# EAGLE design esp32_component (EAGLE 9.5.2)
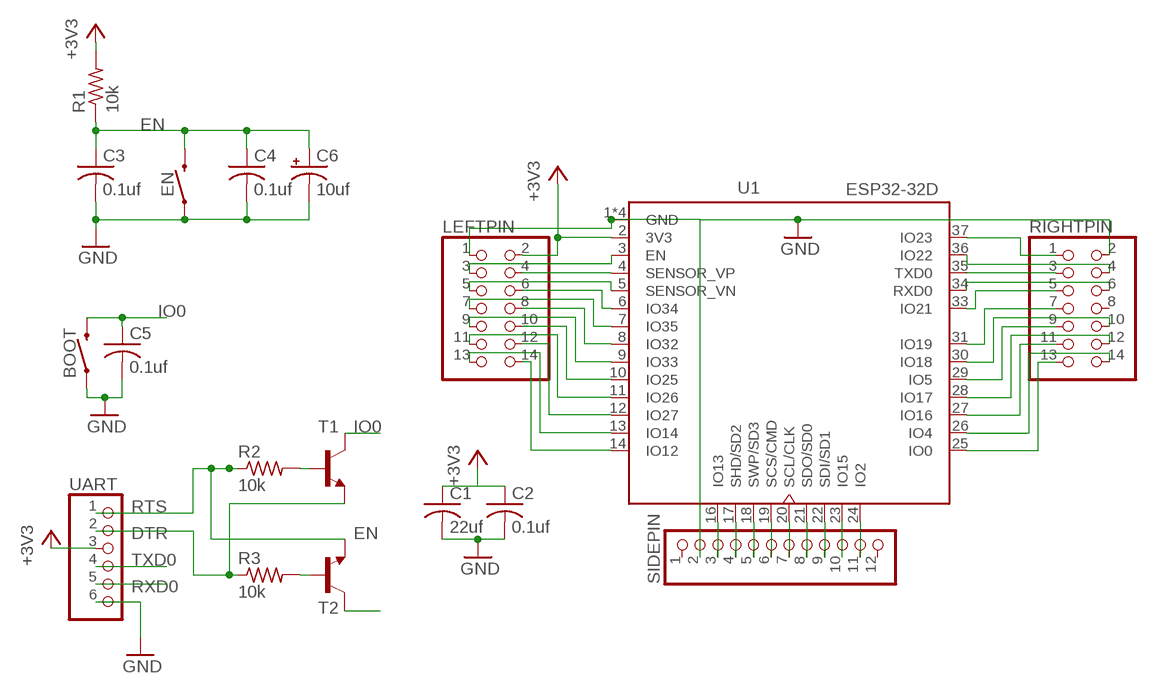
[diagram p0: schematic, sheet 1]

## Parts
BOOT  MOMENTARY-SWITCH-SPST-SMD-4.6X2.8MM  [TACTILE_SWITCH_SMD_4.6X2.8MM]
C1  22uf  C-USC1210  [C1210]
C2  0.1uf  C-USC0805  [C0805]
C3  0.1uf  C-USC0805  [C0805]
C4  0.1uf  C-USC0805  [C0805]
C5  0.1uf  C-USC0805  [C0805]
C6  10uf  CPOL-US153CLV-0605  [153CLV-0605]
EN  MOMENTARY-SWITCH-SPST-SMD-4.6X2.8MM  [TACTILE_SWITCH_SMD_4.6X2.8MM]
LEFTPIN  PINHD-2X7  [2X07]
R1  10k  R-US_R0805  [R0805]
R2  10k  R-US_M0805  [M0805]
R3  10k  R-US_M0805  [M0805]
RIGHTPIN  PINHD-2X7  [2X07]
SIDEPIN  PINHD-1X12  [1X12]
T1  -NPN-SOT23-EBC  [SOT23-EBC]
T2  -NPN-SOT23-EBC  [SOT23-EBC]
U1  ESP32-32D  [MODULE_ESP32-WROOM-32D]
UART  PINHD-1X6  [1X06]

## Nets
+3V3: C1.1 C2.1 LEFTPIN.2 R1.2 U1.2(3V3) UART.3
DTR: R3.1 T1.E UART.2
EN: C3.1 C4.1 C6.+ EN.3 EN.4 LEFTPIN.3 R1.1 T2.C U1.3(EN)
GND: BOOT.1 BOOT.2 C1.2 C2.2 C3.2 C4.2 C5.2 C6.- EN.1 EN.2 LEFTPIN.1 RIGHTPIN.2 SIDEPIN.2 U1.1(GND) U1.15(GND) U1.38(GND) U1.39(GND) UART.6
IO0: BOOT.3 BOOT.4 C5.1 RIGHTPIN.13 T1.C U1.25(IO0)
IO2: SIDEPIN.11 U1.24(IO2)
N$1: R2.2 T1.B
N$2: R3.2 T2.B
N$3: SIDEPIN.10 U1.23(IO15)
N$10: SIDEPIN.3 U1.16(IO13)
N$13: LEFTPIN.4 U1.4(SENSOR_VP)
N$14: LEFTPIN.5 U1.5(SENSOR_VN)
N$15: LEFTPIN.6 U1.6(IO34)
N$16: LEFTPIN.7 U1.7(IO35)
N$17: LEFTPIN.8 U1.8(IO32)
N$18: LEFTPIN.9 U1.9(IO33)
N$19: LEFTPIN.10 U1.10(IO25)
N$20: LEFTPIN.11 U1.11(IO26)
N$21: LEFTPIN.12 U1.12(IO27)
N$22: LEFTPIN.13 U1.13(IO14)
N$23: LEFTPIN.14 U1.14(IO12)
N$24: RIGHTPIN.1 U1.37(IO23)
N$25: RIGHTPIN.4 U1.36(IO22)
N$28: RIGHTPIN.5 U1.33(IO21)
N$29: RIGHTPIN.7 U1.31(IO19)
N$30: RIGHTPIN.10 U1.30(IO18)
N$31: RIGHTPIN.9 U1.29(IO5)
N$33: RIGHTPIN.12 U1.28(IO17)
N$34: RIGHTPIN.11 U1.27(IO16)
N$35: RIGHTPIN.14 U1.26(IO4)
RTS: R2.1 T2.E UART.1
RXD0: RIGHTPIN.6 U1.34(RXD0) UART.5
SCL/CLK: SIDEPIN.7 U1.20(SCL/CLK)
SCS/CMD: SIDEPIN.6 U1.19(SCS/CMD)
SDI/SD1: SIDEPIN.9 U1.22(SDI/SD1)
SDO/SD0: SIDEPIN.8 U1.21(SDO/SD0)
SHD/SD2: SIDEPIN.4 U1.17(SHD/SD2)
SWP/SD3: SIDEPIN.5 U1.18(SWP/SD3)
TXD0: RIGHTPIN.3 U1.35(TXD0) UART.4
Unconnected: RIGHTPIN.8 SIDEPIN.1 SIDEPIN.12

## Library data of the parts
BOOT EN = SparkFun-Switches:MOMENTARY-SWITCH-SPST: Momentary Switch (Pushbutton) - SPST Normally-open (NO) SPST momentary switches (buttons, pushbuttons). Variants PTH-12MM - 12mm square, through-hole Momentary Pushbutton Switch - 12mm Square <https://www.sparkfun.com/products/9190> (COM-09190) PTH-6.0MM, PTH-6.0MM-KIT - 6.0mm square, through-hole Mini Pushbutton Switch <https://www.sparkfun.com/products/97> (COM-00097) KIT package intended for soldering kit's - only one side of pads' copper is exposed. PTH-RIGHT-ANGLE-KIT - Right-angle, through-hole Right Angle Tactile Button <https://www.sparkfun.com/products/10791> - Used on SparkFun BigTime Watch Kit <https://www.sparkfun.com/products/11734> SMD-12MM - 12mm square, surface-mount Tactile Button - SMD (12mm) <https://www.sparkfun.com/products/12993> (COM-12993) Used on SparkFun PicoBoard <https://www.sparkfun.com/products/11888> SMD-4.5MM - 4.5mm Square Trackball Switch Used on SparkFun Blackberry Trackballer Breakout <https://www.sparkfun.com/products/13169> SMD-4.6MMX2.8MM - 4.60mm x 2.80mm, surface mount Used on SparkFun SAMD21 Mini Breakout <https://www.sparkfun.com/products/13664> SMD-5.2MM, SMD-5.2-REDUNDANT - 5.2mm square, surface-mount Mini Pushbutton Switch - SMD <https://www.sparkfun.com/products/8720> (COM-08720) Used on Arduino Pro Mini <https://www.sparkfun.com/products/11114> REDUNDANT package connects both switch circuits together SMD-6.0X3.5MM - 6.0 x 3.5mm, surface mount Momentary Reset Switch SMD <https://www.sparkfun.com/products/8229> (COM-08229) SMD-6.2MM-TALL - 6.2mm square, surface mount Tactile Button - SMD (6mm) <https://www.sparkfun.com/products/12992> Used on SparkFun Digital Sandbox <https://www.sparkfun.com/products/12651> SMD-RIGHT-ANGLE - Right-angle, surface mount Used on SparkFun Block for Intel® Edison - Arduino <https://www.sparkfun.com/products/13036>; PROD_ID: SWCH-13065
C1-C5 = rcl:C-US: CAPACITOR, American symbol; SPICEPREFIX: C
C6 = rcl:CPOL-US: POLARIZED CAPACITOR, American symbol; SPICEPREFIX: C
LEFTPIN RIGHTPIN = pinhead:PINHD-2X7: PIN HEADER
R1-R3 = rcl:R-US_: RESISTOR, American symbol; SPICEPREFIX: R
SIDEPIN = pinhead:PINHD-1X12: PIN HEADER
T1 T2 = transistor:*-NPN-: NPN Transistror BF959 corrected 2008.03.06
U1 = CustomParts:ESP32-32D: IC: SoC; GPIO, I2C, I2S, IR, SD, SDIO, SPI, UART; 2.7÷3.6VDC; 20dBm; AVAILABILITY: Unavailable; DESCRIPTION: Bluetooth, WiFi 802.11b/g/n, Bluetooth v4.2 + EDR, Class 1, 2 and 3 Transceiver Module 2.4GHz ~ 2.5GHz Integrated, Trace Surface Mount; MF: Espressif Systems; MP: ESP32-WROOM-32D; PACKAGE: Module Espressif Systems; PRICE: None
UART = pinhead:PINHD-1X6: PIN HEADER

## Board
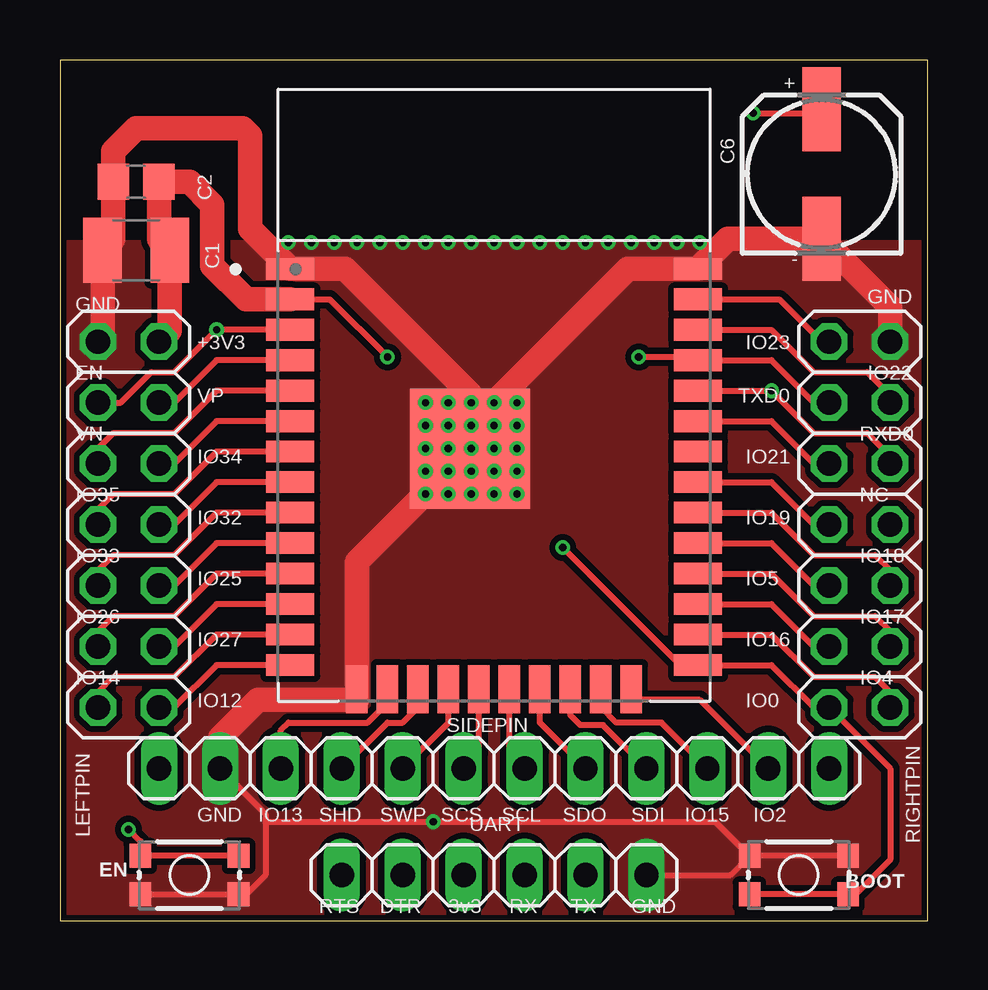
[diagram p1: board, top side]
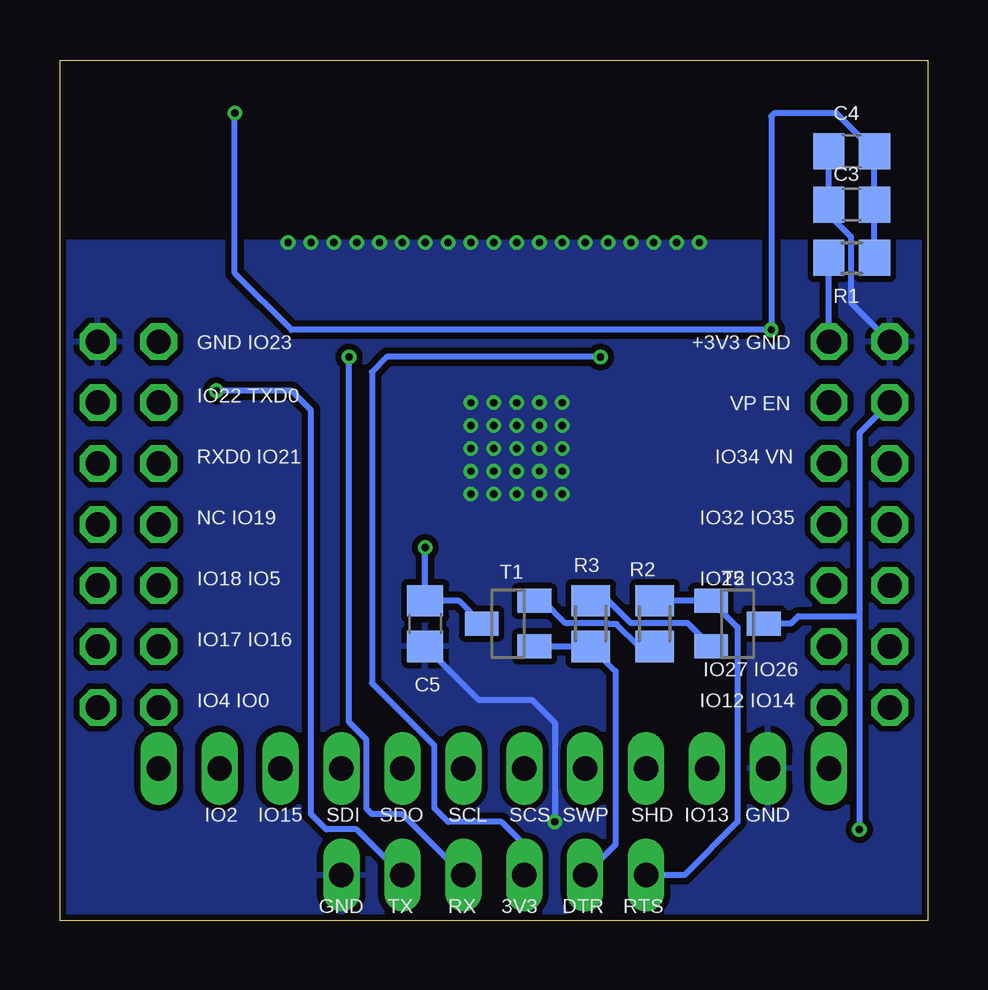
[diagram p2: board, bottom side, seen from below]

Size 36.18 x 35.87 mm. Coordinates in mm from the lower left corner, seen from the top.
Outline: 0,0 36.18,0 36.18,35.87 0,35.87 0,0
Copper layers (1*16): Top 0.035mm / dielectric 1.5mm / Bottom 0.035mm
Design rules "dirt_cheap_dirty_boards.v1.1": minimum track width 6mil, minimum drill 12mil, track to track 6mil, track to pad 6mil, pad to pad 6mil, via to via 6mil, smd to smd 0mil, copper to edge 10mil, drill to drill 10mil, minimum pad ring 10mil, minimum via ring 6mil, stop-mask expansion 2mil, vias tented up to drill 25mil, thermal gap 10mil

### Footprints (pad centres in the part's own frame; a part is rotated, then mirrored left to right if it is on the bottom)
TACTILE_SWITCH_SMD_4.6X2.8MM = smd 0.9 x 1: 1 -2.05,-0.8; 2 2.05,-0.8; 3 2.05,0.8; 4 -2.05,0.8
C1210 = smd 1.6 x 2.7: 1 -1.4,0; 2 1.4,0
C0805 = smd 1.3 x 1.5: 1 -0.95,0; 2 0.95,0
153CLV-0605 = smd 3.5 x 1.6: + 2.7,0; - -2.7,0
2X07 = drill 1.016 octagon: 1 -7.62,-1.27; 2 -7.62,1.27; 3 -5.08,-1.27; 4 -5.08,1.27; 5 -2.54,-1.27; 6 -2.54,1.27; 7 0,-1.27; 8 0,1.27; 9 2.54,-1.27; 10 2.54,1.27; 11 5.08,-1.27; 12 5.08,1.27; 13 7.62,-1.27; 14 7.62,1.27
R0805 = smd 1.3 x 1.5: 1 -0.95,0; 2 0.95,0
M0805 = smd 1.3 x 1.6: 1 -0.95,0; 2 0.95,0
1X12 = drill 1.016 long: 1 -13.97,0; 2 -11.43,0; 3 -8.89,0; 4 -6.35,0; 5 -3.81,0; 6 -1.27,0; 7 1.27,0; 8 3.81,0; 9 6.35,0; 10 8.89,0; 11 11.43,0; 12 13.97,0
SOT23-EBC = smd 1 x 1.4: B 0.95,-1.1; C 0,1.1; E -0.95,-1.1
MODULE_ESP32-WROOM-32D = smd 2 x 0.9: 1 -8.5,5.26; 2 -8.5,3.99; 3 -8.5,2.72; 4 -8.5,1.45; 5 -8.5,0.18; 6 -8.5,-1.09; 7 -8.5,-2.36; 8 -8.5,-3.63; 9 -8.5,-4.9; 10 -8.5,-6.17; 11 -8.5,-7.44; 12 -8.5,-8.71; 13 -8.5,-9.98; 14 -8.5,-11.25; 25 8.5,-11.25; 26 8.5,-9.98; 27 8.5,-8.71; 28 8.5,-7.44; 29 8.5,-6.17; 30 8.5,-4.9; 31 8.5,-3.63; 32 8.5,-2.36; 33 8.5,-1.09; 34 8.5,0.18; 35 8.5,1.45; 36 8.5,2.72; 37 8.5,3.99; 38 8.5,5.26 | smd 0.9 x 2: 15 -5.715,-12.25; 16 -4.445,-12.25; 17 -3.175,-12.25; 18 -1.905,-12.25; 19 -0.635,-12.25; 20 0.635,-12.25; 21 1.905,-12.25; 22 3.175,-12.25; 23 4.445,-12.25; 24 5.715,-12.25 | smd 5 x 5: 39 -1,-2.24
1X06 = drill 1.016 long: 1 -6.35,0; 2 -3.81,0; 3 -1.27,0; 4 1.27,0; 5 3.81,0; 6 6.35,0

### Placement (x,y rotation side)
BOOT  30.8,1.91 180 top
C1  3.18,27.94 180 top
C2  3.18,30.8 180 top
C3  3.18,29.84 180 bottom
C4  3.18,32.07 180 bottom
C5  20.96,12.38 270 bottom
C6  31.75,31.12 90 top
EN  5.4,1.91 0 top
LEFTPIN  2.86,16.51 270 top
R1  3.18,27.62 180 bottom
R2  11.39,12.38 270 bottom
R3  14.05,12.38 90 bottom
RIGHTPIN  33.34,16.51 270 top
SIDEPIN  18.1,6.35 0 top
T1  17.5,12.38 90 bottom
T2  7.94,12.38 270 bottom
U1  18.1,21.91 0 top
UART  18.1,1.91 0 top

### Tracks (layer width: path | path; a pad name or v marks a point on that pad's centre or on a via)
+3V3  (via drill 0.3)
  Top 0.254: U1.2 11.25,25.9 v13.65,23.49
  Top 1.016: U1.2 7.76,25.9 6.35,27.3 6.35,29.84 5.4,30.8 C2.1 4.12,28.39 C1.1 4.57,24.58 LEFTPIN.2
  Bottom 0.254: LEFTPIN.2 R1.2 | v13.65,23.49 22.54,23.49 23.18,22.86 23.18,9.91 20.57,7.3 20.57,4.7 20,4.13 17.78,4.13 16.83,3.18 UART.3
DTR
  Bottom 0.254: T1.E R3.1 13.02,10.4 13.02,3.18 UART.2
EN  (via drill 0.3)
  Top 0.254: U1.3 v6.53,24.63 4.76,22.86 3.81,22.86 2.54,21.59 LEFTPIN.3 | v2.86,3.81 3.35,3.32 EN.4 EN.3 | v28.89,33.66 31.59,33.66 C6.+
  Bottom 0.254: R1.1 C3.1 C4.1 3.81,33.66 6.39,33.66 6.53,33.52 v6.53,24.63 26.53,24.63 28.89,26.99 v28.89,33.66 | LEFTPIN.3 2.86,20.32 2.86,12.7 | 2.86,12.7 v2.86,3.81 | 2.86,12.7 5.4,12.7 5.71,12.38 T2.C
GND  (via drill 0.3)
  Top 0.254: BOOT.1 BOOT.2 | EN.1 EN.2 7.77,1.11 8.57,1.91 8.57,4.13 | SIDEPIN.2 8.57,4.45 8.57,4.13 | 8.57,4.13 v15.56,4.13 27.32,4.13 BOOT.2 | UART.6 27.95,1.91 BOOT.2
  Top 1.016: SIDEPIN.2 6.67,7.62 8.25,9.21 12.38,9.21 U1.15 12.38,14.95 U1.39 | U1.39 17.1,21.95 11.89,27.17 U1.1 7.94,28.83 7.94,32.7 7.62,33.02 3.18,33.02 2.23,32.07 C2.2 2.23,28.39 C1.2 1.77,24.32 LEFTPIN.1 | U1.39 17.1,20.59 23.68,27.17 U1.38 27.85,28.41 C6.- 34.61,25.56 RIGHTPIN.2
  Bottom 0.254: LEFTPIN.1 3.2,25.74 3.2,28.49 4.12,29.42 C3.2 C4.2 | C5.2 18.73,9.21 16.51,9.21 15.56,8.26 v15.56,4.13
  other vias: 15.24,21.59 16.19,21.59 17.14,21.59 18.1,21.59 19.05,21.59 19.05,20.64 19.05,19.69 19.05,18.73 19.05,17.78 18.1,20.64 18.1,19.69 18.1,18.73 18.1,17.78 17.14,20.64 17.14,19.69 17.14,18.73 17.14,17.78 16.19,20.64 16.19,19.69 16.19,18.73 16.19,17.78 15.24,20.64 15.24,19.69 15.24,18.73 15.24,17.78 26.67,28.26 25.72,28.26 24.76,28.26 23.81,28.26 22.86,28.26 21.91,28.26 20.96,28.26 20,28.26 19.05,28.26 18.1,28.26 17.14,28.26 16.19,28.26 15.24,28.26 14.29,28.26 13.33,28.26 12.38,28.26 11.43,28.26 10.48,28.26 9.53,28.26
  pour Bottom (isolate 0.254): 0,28.26 36.19,28.26 36.19,0 0,0
  pour Top (isolate 0.254, no thermals): 0,28.26 36.19,28.26 36.19,0 0,0
IO0  (via drill 0.3)
  Top 0.254: BOOT.3 BOOT.4 33.17,1.11 34.61,2.54 34.61,6.35 RIGHTPIN.13 31.43,8.89 29.67,10.66 U1.25 25.86,10.66 v20.96,15.56
  Bottom 0.254: T1.C 19.55,13.33 C5.1 v20.96,15.56
IO2
  Top 0.254: SIDEPIN.11 26.67,9.21 24.26,9.21 U1.24
N$1
  Bottom 0.254: R2.2 12.05,11.43 12.98,12.36 13.31,12.36 13.36,12.4 15.12,12.4 16.05,13.33 T1.B
N$2
  Bottom 0.254: T2.B 9.92,12.31 9.99,12.38 10.01,12.4 12.39,12.4 13.31,13.33 R3.2
N$3
  Top 0.254: SIDEPIN.10 25.08,8.26 23.18,8.26 22.54,8.89 U1.23
N$10
  Top 0.254: SIDEPIN.3 9.21,7.94 9.53,8.26 12.82,8.26 13.65,9.08 U1.16
N$13
  Top 0.254: U1.4 6.53,23.36 4.76,21.59 LEFTPIN.4
N$14
  Top 0.254: U1.5 6.53,22.09 4.76,20.32 2.22,20.32 1.59,19.69 LEFTPIN.5
N$15
  Top 0.254: U1.6 6.53,20.82 4.76,19.05 LEFTPIN.6
N$16
  Top 0.254: U1.7 6.53,19.55 4.76,17.78 2.22,17.78 1.59,17.15 LEFTPIN.7
N$17
  Top 0.254: U1.8 6.53,18.28 4.76,16.51 LEFTPIN.8
N$18
  Top 0.254: U1.9 6.53,17.01 4.76,15.24 2.22,15.24 1.59,14.6 LEFTPIN.9
N$19
  Top 0.254: U1.10 6.53,15.74 4.76,13.97 LEFTPIN.10
N$20
  Top 0.254: U1.11 6.53,14.47 4.76,12.7 2.22,12.7 1.59,12.06 LEFTPIN.11
N$21
  Top 0.254: U1.12 6.53,13.2 4.76,11.43 LEFTPIN.12
N$22
  Top 0.254: U1.13 6.53,11.93 4.76,10.16 2.22,10.16 1.59,9.52 LEFTPIN.13
N$23
  Top 0.254: U1.14 6.53,10.66 4.76,8.89 LEFTPIN.14
N$24
  Top 0.254: U1.37 29.98,25.9 31.75,24.13 RIGHTPIN.1
N$25
  Top 0.254: U1.36 29.67,24.63 31.43,22.86 33.66,22.86 34.61,21.91 RIGHTPIN.4
N$28
  Top 0.254: U1.33 29.67,20.82 31.43,19.05 RIGHTPIN.5
N$29
  Top 0.254: U1.31 29.67,18.28 31.43,16.51 RIGHTPIN.7
N$30
  Top 0.254: U1.30 29.67,17.01 31.43,15.24 33.97,15.24 34.61,14.6 RIGHTPIN.10
N$31
  Top 0.254: U1.29 29.67,15.74 31.43,13.97 RIGHTPIN.9
N$33
  Top 0.254: U1.28 29.67,14.47 31.43,12.7 33.97,12.7 34.61,12.06 RIGHTPIN.12
N$34
  Top 0.254: U1.27 29.67,13.2 31.43,11.43 RIGHTPIN.11
N$35
  Top 0.254: U1.26 29.67,11.93 31.43,10.16 33.97,10.16 34.61,9.52 RIGHTPIN.14
RTS
  Bottom 0.254: R2.1 T2.E 7.94,12.23 7.94,4.13 10.16,1.91 UART.1
RXD0  (via drill 0.3)
  Top 0.254: U1.34 v29.67,22.09 31.43,20.32 33.66,20.32 34.61,19.37 RIGHTPIN.6
  Bottom 0.254: v29.67,22.09 26.53,22.09 25.72,21.27 25.72,4.45 25.08,3.81 23.81,3.81 UART.5
SCL/CLK
  Top 0.254: SIDEPIN.7 18.73,6.98 U1.20
SCS/CMD
  Top 0.254: SIDEPIN.6 17.46,6.98 U1.19
SDI/SD1
  Top 0.254: SIDEPIN.9 22.64,8.15 21.69,8.15 21.27,8.57 U1.22
SDO/SD0
  Top 0.254: SIDEPIN.8 20,8.26 U1.21
SHD/SD2
  Top 0.254: U1.17 14.92,8.89 14.29,8.26 13.65,8.26 SIDEPIN.4
SWP/SD3
  Top 0.254: SIDEPIN.5 16.19,8.26 U1.18
TXD0  (via drill 0.3)
  Top 0.254: RIGHTPIN.3 31.43,21.59 29.67,23.36 U1.35 26.46,23.49 v24.13,23.49
  Bottom 0.254: UART.4 21.91,4.45 23.18,4.45 23.41,4.67 23.41,7.54 24.13,8.27 v24.13,23.49

### Text on the board
tPlace: + | - | GND | GND | +3V3 | IO23 | EN | IO22 | VP | TXD0 | VN | RXD0 | IO34 | IO21 | IO35 | NC | IO32 | IO19 | IO33 | IO18 | IO25 | IO5 | IO26 | IO17 | IO27 | IO16 | IO14 | IO4 | IO12 | IO0 | GND | IO13 | SHD | SWP | SCS | SCL | SDO | SDI | IO15 | IO2 | RTS | DTR | 3v3 | RX | TX | GND
bPlace: +3V3 GND | GND IO23 | VP EN | IO22 TXD0 | IO34 VN | RXD0 IO21 | IO32 IO35 | NC IO19 | IO25 IO33 | IO18 IO5 | IO17 IO16 | IO27 IO26 | IO12 IO14 | IO4 IO0 | GND | IO13 | SHD | SWP | SCS | SCL | SDO | SDI | IO15 | IO2 | RTS | DTR | 3V3 | RX | TX | GND